# EAGLE design EXT-PHY (EAGLE 9.6.2)
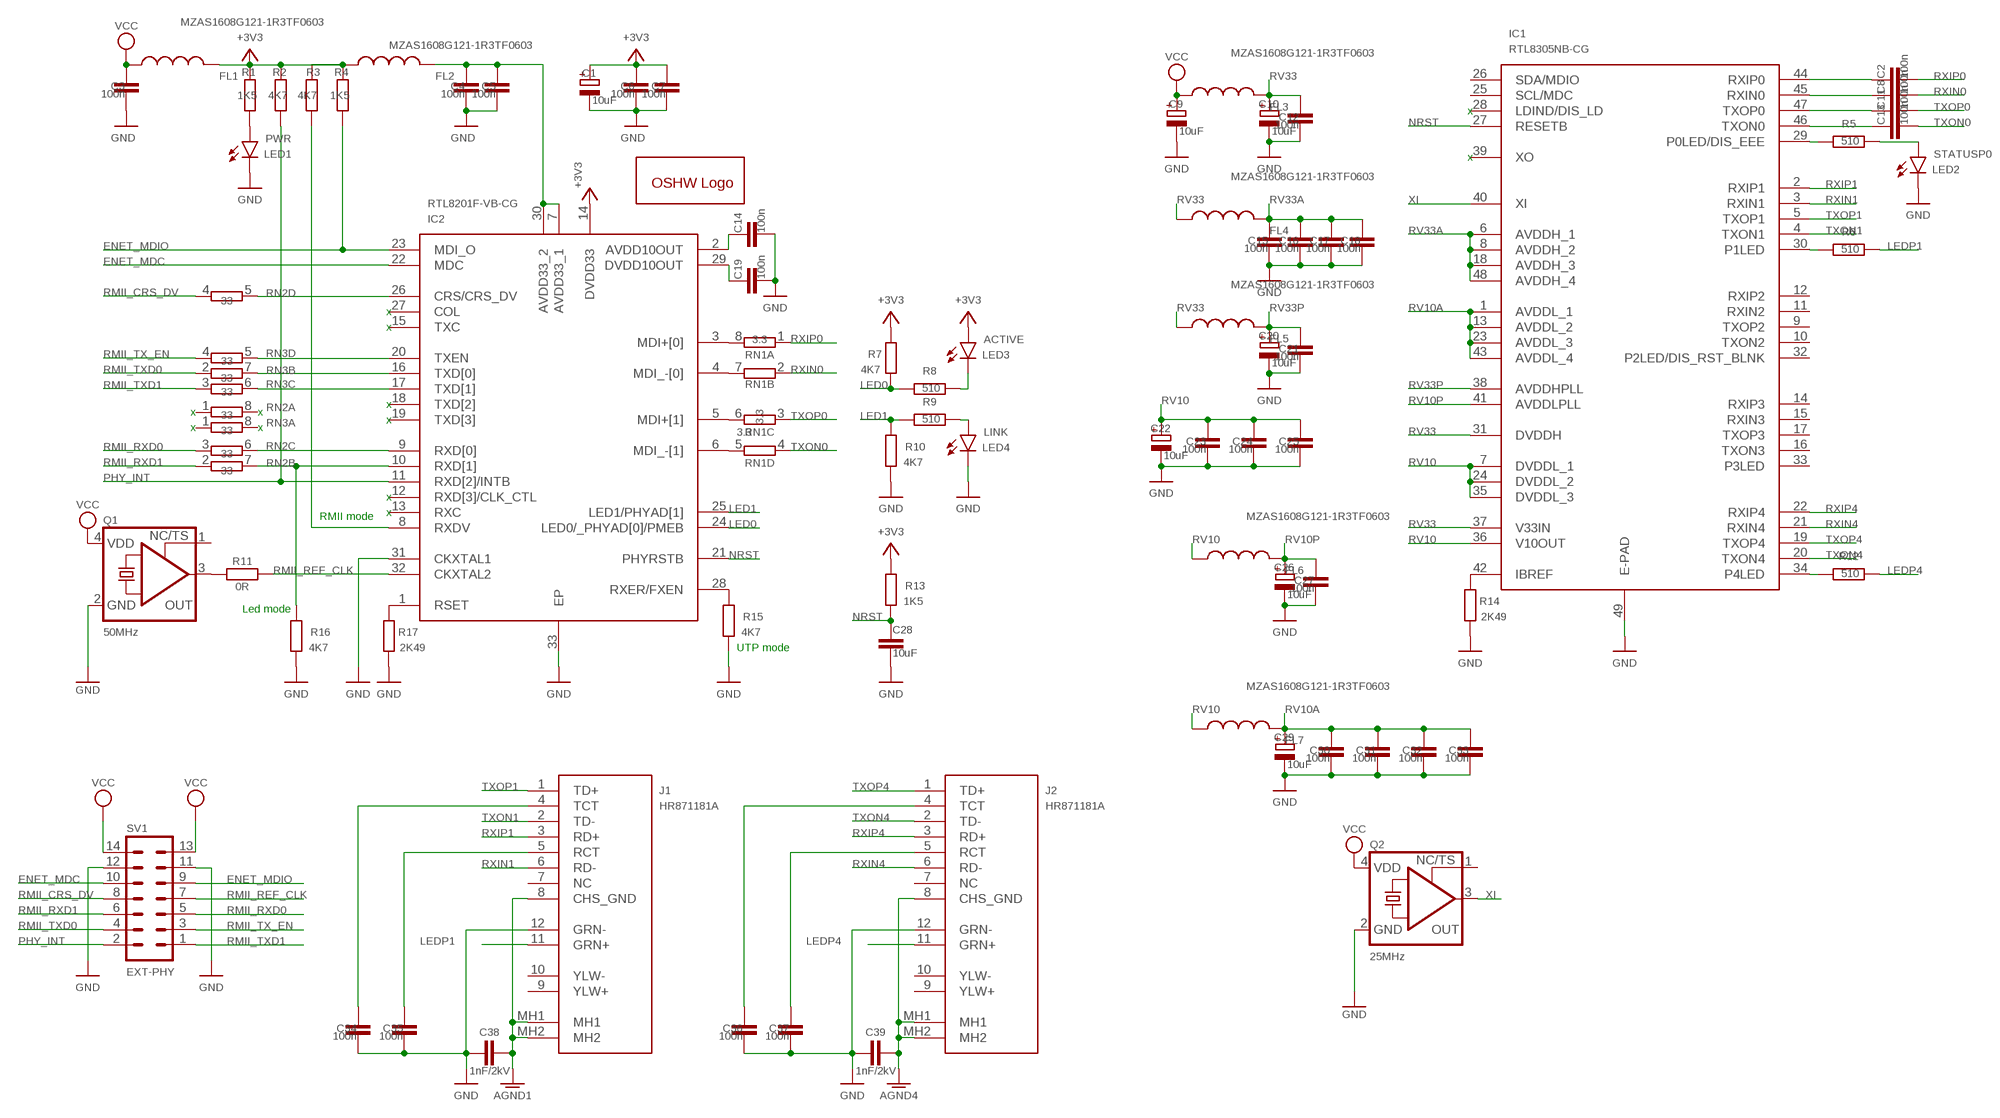
[diagram p0: schematic, sheet 1]

## Parts
C1  10uF  CPOL-EUA/3216-18R  [A/3216-18R]
C2  100n  C-EUC0402  [C0402]
C3  100n  C-EUC0402  [C0402]
C4  100n  C-EUC0402  [C0402]
C5  100n  C-EUC0402  [C0402]
C6  100n  C-EUC0402  [C0402]
C7  100n  C-EUC0402  [C0402]
C8  100n  C-EUC0402  [C0402]
C9  10uF  CPOL-EUA/3216-18R  [A/3216-18R]
C10  10uF  CPOL-EUA/3216-18R  [A/3216-18R]
C11  100n  C-EUC0402  [C0402]
C12  100n  C-EUC0402  [C0402]
C13  100n  C-EUC0402  [C0402]
C14  100n  C-EUC0402  [C0402]
C15  100n  C-EUC0402  [C0402]
C16  100n  C-EUC0402  [C0402]
C17  100n  C-EUC0402  [C0402]
C18  100n  C-EUC0402  [C0402]
C19  100n  C-EUC0402  [C0402]
C20  10uF  CPOL-EUA/3216-18R  [A/3216-18R]
C21  100n  C-EUC0402  [C0402]
C22  10uF  CPOL-EUA/3216-18R  [A/3216-18R]
C23  100n  C-EUC0402  [C0402]
C24  100n  C-EUC0402  [C0402]
C25  100n  C-EUC0402  [C0402]
C26  10uF  CPOL-EUA/3216-18R  [A/3216-18R]
C27  100n  C-EUC0402  [C0402]
C28  10uF  C-EUC0603  [C0603]
C29  10uF  CPOL-EUA/3216-18R  [A/3216-18R]
C30  100n  C-EUC0402  [C0402]
C31  100n  C-EUC0402  [C0402]
C32  100n  C-EUC0402  [C0402]
C33  100n  C-EUC0402  [C0402]
C34  100n  C-EUC0402  [C0402]
C35  100n  C-EUC0402  [C0402]
C36  100n  C-EUC0402  [C0402]
C37  100n  C-EUC0402  [C0402]
C38  1nF/2kV  C-EUC1206  [C1206]
C39  1nF/2kV  C-EUC1206  [C1206]
FL1  MZAS1608G121-1R3TF0603  [0603]
FL2  MZAS1608G121-1R3TF0603  [0603]
FL3  MZAS1608G121-1R3TF0603  [0603]
FL4  MZAS1608G121-1R3TF0603  [0603]
FL5  MZAS1608G121-1R3TF0603  [0603]
FL6  MZAS1608G121-1R3TF0603  [0603]
FL7  MZAS1608G121-1R3TF0603  [0603]
GOLD_ORB_SM1  OSHWLOGOLOGO5MM  [OSHW_5MM]
IC1  RTL8305NB-CG  [QFN40P600X600X100-49N]
IC2  RTL8201F-VB-CG  [QFN50P500X500X100-33N]
J1  HR871181A  [HR871181A]
J2  HR871181A  [HR871181A]
LED1  PWR  LEDCHIP-LED0603  [CHIP-LED0603]
LED2  STATUSP0  LEDCHIP-LED0603  [CHIP-LED0603]
LED3  ACTIVE  LEDCHIP-LED0603  [CHIP-LED0603]
LED4  LINK  LEDCHIP-LED0603  [CHIP-LED0603]
Q1  50MHz  KXO-PXO/XO-V96  [3.2X2.5_KXO-V96]
Q2  25MHz  KXO-PXO/XO-V96  [3.2X2.5_KXO-V96]
R1  1K5  R-EU_R0603  [R0603]
R2  4K7  R-EU_R0603  [R0603]
R3  4K7  R-EU_R0603  [R0603]
R4  1K5  R-EU_R0603  [R0603]
R5  510  R-EU_R0603  [R0603]
R6  510  R-EU_R0603  [R0603]
R7  4K7  R-EU_R0603  [R0603]
R8  510  R-EU_R0603  [R0603]
R9  510  R-EU_R0603  [R0603]
R10  4K7  R-EU_R0603  [R0603]
R11  0R  R-EU_R0603  [R0603]
R12  510  R-EU_R0603  [R0603]
R13  1K5  R-EU_R0603  [R0603]
R14  2K49  R-EU_R0603  [R0603]
R15  4K7  R-EU_R0603  [R0603]
R16  4K7  R-EU_R0603  [R0603]
R17  2K49  R-EU_R0603  [R0603]
RN1  3.3  4R-N0402ARV341  [4X0402ARV341]
RN2  33  4R-N0402ARV341  [4X0402ARV341]
RN3  33  4R-N0402ARV341  [4X0402ARV341]
SV1  EXT-PHY  MA07-2W  [MA07-2W]

## Nets
50MHZ: Q1.3(OUT) R11.1
+3V3: C1.+ C6.2 C7.2 FL1.2 FL2.1 IC2.14(DVDD33) LED3.A R1.2 R2.2 R3.1 R4.2 R7.2 R13.2
AGND1: C38.2 J1.8(CHS_GND) J1.MH1 J1.MH2
AGND4: C39.2 J2.8(CHS_GND) J2.MH1 J2.MH2
AVDD: C4.2 C5.2 FL2.2 IC2.7(AVDD33_1) IC2.30(AVDD33_2)
ENET_MDC: IC2.22(MDC) SV1.10
ENET_MDIO: IC2.23(MDI_O) R4.1 SV1.9
GND: C1.- C3.1 C4.1 C5.1 C6.1 C7.1 C9.- C10.- C12.1 C14.2 C15.1 C16.1 C17.1 C18.1 C19.2 C20.- C21.1 C22.- C23.1 C24.1 C25.1 C26.- C27.1 C28.2 C29.- C30.1 C31.1 C32.1 C33.1 C34.1 C35.1 C36.1 C37.1 C38.1 C39.1 IC1.49(E-PAD) IC2.31(CKXTAL1) IC2.33(EP) J1.12(GRN-) J2.12(GRN-) LED1.C LED2.C LED4.C Q1.2(GND) Q2.2(GND) R10.1 R14.2 R15.1 R16.1 R17.2 SV1.11 SV1.12
LED0: IC2.24(LED0/_PHYAD[0]/PMEB) R7.1 R8.2
LED1: IC2.25(LED1/PHYAD[1]) R9.2 R10.2
LEDP1: J1.11(GRN+) R6.1
LEDP4: J2.11(GRN+) R12.1
N$1: LED1.A R1.1
N$2: C37.2 J2.5(RCT)
N$3: C36.2 J2.4(TCT)
N$4: IC2.1(RSET) R17.1
N$5: IC2.8(RXDV) R3.2
N$6: C14.1 IC2.2(AVDD10OUT)
N$7: IC2.28(RXER/FXEN) R15.2
N$8: IC1.42(IBREF) R14.1
N$9: C35.2 J1.5(RCT)
N$10: C34.2 J1.4(TCT)
N$11: C19.1 IC2.29(DVDD10OUT)
N$12: IC1.30(P1LED) R6.2
N$13: IC1.34(P4LED) R12.2
N$14: IC2.3(MDI+[0]) RN1.8
N$15: LED3.C R8.1
N$16: IC2.4(MDI_-[0]) RN1.7
N$17: IC2.5(MDI+[1]) RN1.6
N$18: IC2.6(MDI_-[1]) RN1.5
N$19: LED2.A R5.1
N$20: IC1.29(P0LED/DIS_EEE) R5.2
N$24: C13.1 IC1.46(TXON0)
N$26: C11.1 IC1.47(TXOP0)
N$27: C8.1 IC1.45(RXIN0)
N$28: C2.1 IC1.44(RXIP0)
N$29: LED4.A R9.1
NRST: C28.1 IC1.27(RESETB) IC2.21(PHYRSTB) R13.1
PHY_INT: IC2.11(RXD[2]/INTB) R2.1 SV1.2
RMII_CRS_DV: RN2.4 SV1.8
RMII_REF_CLK: IC2.32(CKXTAL2) R11.2 SV1.7
RMII_RXD0: RN2.3 SV1.5
RMII_RXD1: RN2.2 SV1.6
RMII_TX_EN: RN3.4 SV1.3
RMII_TXD0: RN3.2 SV1.4
RMII_TXD1: RN3.3 SV1.1
RV10: C22.+ C23.2 C24.2 C25.2 FL6.1 FL7.1 IC1.7(DVDDL_1) IC1.24(DVDDL_2) IC1.35(DVDDL_3) IC1.36(V10OUT)
RV10A: C29.+ C30.2 C31.2 C32.2 C33.2 FL7.2 IC1.1(AVDDL_1) IC1.13(AVDDL_2) IC1.23(AVDDL_3) IC1.43(AVDDL_4)
RV10P: C26.+ C27.2 FL6.2 IC1.41(AVDDLPLL)
RV33: C10.+ C12.2 FL3.2 FL4.1 FL5.1 IC1.31(DVDDH) IC1.37(V33IN)
RV33A: C15.2 C16.2 C17.2 C18.2 FL4.2 IC1.6(AVDDH_1) IC1.8(AVDDH_2) IC1.18(AVDDH_3) IC1.48(AVDDH_4)
RV33P: C20.+ C21.2 FL5.2 IC1.38(AVDDHPLL)
RXD0: IC2.9(RXD[0]) RN2.6
RXD1: IC2.10(RXD[1]) R16.2 RN2.7
RXDV: IC2.26(CRS/CRS_DV) RN2.5
RXIN0: C8.2 RN1.2
RXIN1: IC1.3(RXIN1) J1.6(RD-)
RXIN4: IC1.21(RXIN4) J2.6(RD-)
RXIP0: C2.2 RN1.1
RXIP1: IC1.2(RXIP1) J1.3(RD+)
RXIP4: IC1.22(RXIP4) J2.3(RD+)
TXD0: IC2.16(TXD[0]) RN3.7
TXD1: IC2.17(TXD[1]) RN3.6
TXEN: IC2.20(TXEN) RN3.5
TXON0: C13.2 RN1.4
TXON1: IC1.4(TXON1) J1.2(TD-)
TXON4: IC1.20(TXON4) J2.2(TD-)
TXOP0: C11.2 RN1.3
TXOP1: IC1.5(TXOP1) J1.1(TD+)
TXOP4: IC1.19(TXOP4) J2.1(TD+)
VCC: C3.2 C9.+ FL1.1 FL3.1 Q1.4(VDD) Q2.4(VDD) SV1.13 SV1.14
XI: IC1.40(XI) Q2.3(OUT)
Unconnected: IC1.9(TXOP2) IC1.10(TXON2) IC1.11(RXIN2) IC1.12(RXIP2) IC1.14(RXIP3) IC1.15(RXIN3) IC1.16(TXON3) IC1.17(TXOP3) IC1.25(SCL/MDC) IC1.26(SDA/MDIO) IC1.28(LDIND/DIS_LD) IC1.32(P2LED/DIS_RST_BLNK) IC1.33(P3LED) IC1.39(XO) IC2.12(RXD[3]/CLK_CTL) IC2.13(RXC) IC2.15(TXC) IC2.18(TXD[2]) IC2.19(TXD[3]) IC2.27(COL) J1.7(NC) J1.9(YLW+) J1.10(YLW-) J2.7(NC) J2.9(YLW+) J2.10(YLW-) Q1.1(TS) Q2.1(TS) RN2.1 RN2.8 RN3.1 RN3.8

## Notes on the sheet
- x
- x
- x
- x
- x
- x | x
- x
- x | x
- x
- x
- RMII mode
- Led mode
- UTP mode

## Library data of the parts
C1 C9 C10 C20 C22 C26 C29 = rcl:CPOL-EU: POLARIZED CAPACITOR, European symbol; JLCPCB: C7171; SPICEPREFIX: C
C2-C8 C11-C19 C21 C23-C25 C27 C30-C37 = rcl:C-EU: CAPACITOR, European symbol; JLCPCB: C1525; SPICEPREFIX: C
C28 = rcl:C-EU: CAPACITOR, European symbol; JLCPCB: C19702; SPICEPREFIX: C
C38 C39 = rcl:C-EU: CAPACITOR, European symbol; JLCPCB: C9196; SPICEPREFIX: C
FL1-FL7 = Ethernet:MZAS1608G121-1R3TF: 1.3A 1 140mΩ 120Ω@100MHz ±25% 0603 Ferrite Beads ROHS; JLCPCB: C709642
GOLD_ORB_SM1 = oshw:OSHWLOGO: The OSHW logo for PCB layout
IC1 = Ethernet:RTL8305NB-CG: 5-port 10/100 Network switch Source: Datasheet <https://www.openhacks.com/uploadsproductos/realtek-semicon-rtl8305nb-cg-qfn-48_c52146.pdf>; DESCRIPTION: 5-port 10/100 Network switch; JLCPCB: C3010343; MANUFACTURER_NAME: Realtek; MANUFACTURER_PART_NUMBER: RTL8305NB-CG
IC2 = Ethernet:RTL8201F-VB-CG: RTL8201F Series 3.63 V Single Chip/Port 10/100 M Ethernet Phyceiver w/ auto MDIX Source: Datasheet <https://pdf1.alldatasheet.com/datasheet-pdf/view/1132250/REALTEK/RTL8201F-VB-CG.html>; DESCRIPTION: RTL8201F Series 3.63 V Single Chip/Port 10/100 M Ethernet Phyceiver w/ auto MDIX; JLCPCB: C45044; MANUFACTURER_NAME: Realtek; MANUFACTURER_PART_NUMBER: RTL8201F-VB-CG
J1 J2 = Ethernet:HR871181A: RJ45 12 1 Shielded Green - Yellow Through Hole Ethernet Connectors/Modular Connectors (RJ45 RJ11) RoHS Source: Datasheet <https://datasheet.lcsc.com/szlcsc/1811141116_HANRUN-Zhongshan-HanRun-Elec-HR871181A_C49312.pdf>; DESCRIPTION: RJ45 12 1 Shielded Green - Yellow Through Hole Ethernet Connectors/Modular Connectors (RJ45 RJ11) RoHS; JLCPCB: C49312; MANUFACTURER_NAME: Hanrun Electronics; MANUFACTURER_PART_NUMBER: HR871181A
LED1-LED4 = led:LED: LED OSRAM: - CHIPLED LG R971, LG N971, LY N971, LG Q971, LY Q971, LO R971, LY R971 LH N974, LH R974 LS Q976, LO Q976, LY Q976 LO Q996 - Hyper CHIPLED LW Q18S LB Q993, LB Q99A, LB R99A - SideLED LS A670, LO A670, LY A670, LG A670, LP A670 LB A673, LV A673, LT A673, LW A673 LH A674 LY A675 LS A676, LA A676, LO A676, LY A676, LW A676 LS A679, LY A679, LG A679 - Hyper Micro SIDELED® LS Y876, LA Y876, LO Y876, LY Y876 LT Y87S - SmartLED LW L88C, LW L88S LB L89C, LB L89S, LG L890 LS L89K, LO L89K, LY L89K LS L896, LA L896, LO L896, LY L896 - TOPLED LS T670, LO T670, LY T670, LG T670, LP T670 LSG T670, LSP T670, LSY T670, LOP T670, LYG T670 LG T671, LOG T671, LSG T671 LB T673, LV T673, LT T673, LW T673 LH T674 LS T676, LA T676, LO T676, LY T676, LB T676, LH T676, LSB T676, LW T676 LB T67C, LV T67C, LT T67C, LS T67K, LO T67K, LY T67K, LW E67C LS E67B, LA E67B, LO E67B, LY E67B, LB E67C, LV E67C, LT E67C LW T67C LS T679, LY T679, LG T679 LS T770, LO T770, LY T770, LG T770, LP T770 LB T773, LV T773, LT T773, LW T773 LH T774 LS E675, LA E675, LY E675, LS T675 LS T776, LA T776, LO T776, LY T776, LB T776 LHGB T686 LT T68C, LB T68C - Hyper Mini TOPLED® LB M676 - Mini TOPLED Santana® LG M470 LS M47K, LO M47K, LY M47K Source: http://www.osram.convergy.de LUXEON: - LUMILED® LXK2-PW12-R00, LXK2-PW12-S00, LXK2-PW14-U00, LXK2-PW14-V00 LXK2-PM12-R00, LXK2-PM12-S00, LXK2-PM14-U00 LXK2-PE12-Q00, LXK2-PE12-R00, LXK2-PE12-S00, LXK2-PE14-T00, LXK2-PE14-U00 LXK2-PB12-K00, LXK2-PB12-L00, LXK2-PB12-M00, LXK2-PB14-N00, LXK2-PB14-P00, LXK2-PB14-Q00 LXK2-PR12-L00, LXK2-PR12-M00, LXK2-PR14-Q00, LXK2-PR14-R00 LXK2-PD12-Q00, LXK2-PD12-R00, LXK2-PD12-S00 LXK2-PH12-R00, LXK2-PH12-S00 LXK2-PL12-P00, LXK2-PL12-Q00, LXK2-PL12-R00 Source: www.luxeon.com KINGBRIGHT: KA-3528ASYC Source: www.kingbright.com; JLCPCB: C72043
Q1 = crystal-geyer_V1_0:KXO-PXO/XO-V: Clock Oscillator (PXO/XO) MHz : KXO-V - Serie Model Size l/w/h [mm] Frequency Range Frequency Stability Temp. Range [°C] Output AECQ 200 availabel Datasheet KXO-V94 KXO-V94 KXO-V95 KXO-V95 KXO-V96 KXO-V96 KXO-V99 KXO-V99 KXO-97 KXO-V97 KXO-97 - KXO-V97 2.0/1.6/0.80 2.0/1.6/0.80 2.5/2.0/0.82 2.5/2.0/0.82 3.2/2.5/1.2 3.2/2.5/1.2 5.0/3.2/1.2 5.0/3.2/1.2 7.0/5.08/1.3 7.0/5.08/1.3 7.0/5.08/1.3 32,768 kHz 1,0 ~ 80,0 MHz 32,768 kHz 1,0 ~ 70,0 MHz 32,768 kHz 1,0 ~ 156,0 MHz 32,768 kHz 1,0 ~ 200,0 MHz 32,768 kHz 32,768 kHz 1,0 ~ 160,0 MHz ±25 … ±100ppm ±25 … ±100ppm ±25 … ±100ppm ±25 … ±100ppm ±25 … ±100ppm ±25 … ±100ppm ±25 … ±100ppm ±25 … ±100ppm ±25 … ±100ppm ±25 … ±100ppm ±25 … ±100ppm (*) -40°C …+85°C (*) -40°C …+85°C (*) -40°C …+85°C (*) -40°C …+85°C (*) -40°C …+85°C (*) -40°C …+85°C (*) -40°C …+85°C (*) -40°C …+85°C (*) -40°C …+85°C (*) -40°C …+85°C (*) -40°C …+85°C HCMOS HCMOS HCMOS HCMOS HCMOS HCMOS HCMOS HCMOS HCMOS HCMOS HCMOS - - yes yes yes yes - - - - - KXO-V94-kHz.pdf <http://www.geyer-electronic.de/uploads/tx_userartikelfrequenz/GEYER-KXO-V94-kHz.pdf> KXO-V94.pdf <http://www.geyer-electronic.de/uploads/tx_userartikelfrequenz/GEYER-KXO-V94.pdf> KXO-V95-kHz.pdf <http://www.geyer-electronic.de/uploads/tx_userartikelfrequenz/GEYER-KXO-V95-kHz.pdf> KXO-V95.pdf <http://www.geyer-electronic.de/uploads/tx_userartikelfrequenz/GEYER-KXO-V95.pdf> KXO-V96-kHz.pdf <http://www.geyer-electronic.de/uploads/tx_userartikelfrequenz/GEYER-KXO-V96-kHz.pdf> KXO-V96.pdf <http://www.geyer-electronic.de/uploads/tx_userartikelfrequenz/GEYER-KXO-V96.pdf> KXO-V99-kHz.pdf <http://www.geyer-electronic.de/uploads/tx_userartikelfrequenz/GEYER-KXO-V99-kHz.pdf> KXO-V99.pdf <http://www.geyer-electronic.de/uploads/tx_userartikelfrequenz/GEYER-KXO-V99.pdf> KXO-97-kHz.pdf <http://www.geyer-electronic.de/uploads/tx_userartikelfrequenz/GEYER-KXO-97-kHz.pdf> KXO-V97-kHz.pdf <http://www.geyer-electronic.de/uploads/tx_userartikelfrequenz/GEYER-KXO-V97-kHz.pdf> KXO-V97.pdf <http://www.geyer-electronic.de/uploads/tx_userartikelfrequenz/GEYER-KXO-V97.pdf> <http://www.geyer-electronic.de/fileadmin/template/img/logo-geyer-electronic.png> Details see: http://www.geyer-electronic.de/Frequenz-Produkte.9.0.html Created 2016-06-07, Hans Locher 2016 (C) Geyer Quartz Technology Hans Locher KXOV94,KXOV95;KXOV96;KXOV97;KXO97;2016;2520;3225;5032;70508;2,5x2,0;3,2x2,5;5,0x3,2;7,0x5,08;2.5x2.0;3.2x2.5;5.0x3.2;7.0x5.08;; JLCPCB: C160451
Q2 = crystal-geyer_V1_0:KXO-PXO/XO-V: Clock Oscillator (PXO/XO) MHz : KXO-V - Serie Model Size l/w/h [mm] Frequency Range Frequency Stability Temp. Range [°C] Output AECQ 200 availabel Datasheet KXO-V94 KXO-V94 KXO-V95 KXO-V95 KXO-V96 KXO-V96 KXO-V99 KXO-V99 KXO-97 KXO-V97 KXO-97 - KXO-V97 2.0/1.6/0.80 2.0/1.6/0.80 2.5/2.0/0.82 2.5/2.0/0.82 3.2/2.5/1.2 3.2/2.5/1.2 5.0/3.2/1.2 5.0/3.2/1.2 7.0/5.08/1.3 7.0/5.08/1.3 7.0/5.08/1.3 32,768 kHz 1,0 ~ 80,0 MHz 32,768 kHz 1,0 ~ 70,0 MHz 32,768 kHz 1,0 ~ 156,0 MHz 32,768 kHz 1,0 ~ 200,0 MHz 32,768 kHz 32,768 kHz 1,0 ~ 160,0 MHz ±25 … ±100ppm ±25 … ±100ppm ±25 … ±100ppm ±25 … ±100ppm ±25 … ±100ppm ±25 … ±100ppm ±25 … ±100ppm ±25 … ±100ppm ±25 … ±100ppm ±25 … ±100ppm ±25 … ±100ppm (*) -40°C …+85°C (*) -40°C …+85°C (*) -40°C …+85°C (*) -40°C …+85°C (*) -40°C …+85°C (*) -40°C …+85°C (*) -40°C …+85°C (*) -40°C …+85°C (*) -40°C …+85°C (*) -40°C …+85°C (*) -40°C …+85°C HCMOS HCMOS HCMOS HCMOS HCMOS HCMOS HCMOS HCMOS HCMOS HCMOS HCMOS - - yes yes yes yes - - - - - KXO-V94-kHz.pdf <http://www.geyer-electronic.de/uploads/tx_userartikelfrequenz/GEYER-KXO-V94-kHz.pdf> KXO-V94.pdf <http://www.geyer-electronic.de/uploads/tx_userartikelfrequenz/GEYER-KXO-V94.pdf> KXO-V95-kHz.pdf <http://www.geyer-electronic.de/uploads/tx_userartikelfrequenz/GEYER-KXO-V95-kHz.pdf> KXO-V95.pdf <http://www.geyer-electronic.de/uploads/tx_userartikelfrequenz/GEYER-KXO-V95.pdf> KXO-V96-kHz.pdf <http://www.geyer-electronic.de/uploads/tx_userartikelfrequenz/GEYER-KXO-V96-kHz.pdf> KXO-V96.pdf <http://www.geyer-electronic.de/uploads/tx_userartikelfrequenz/GEYER-KXO-V96.pdf> KXO-V99-kHz.pdf <http://www.geyer-electronic.de/uploads/tx_userartikelfrequenz/GEYER-KXO-V99-kHz.pdf> KXO-V99.pdf <http://www.geyer-electronic.de/uploads/tx_userartikelfrequenz/GEYER-KXO-V99.pdf> KXO-97-kHz.pdf <http://www.geyer-electronic.de/uploads/tx_userartikelfrequenz/GEYER-KXO-97-kHz.pdf> KXO-V97-kHz.pdf <http://www.geyer-electronic.de/uploads/tx_userartikelfrequenz/GEYER-KXO-V97-kHz.pdf> KXO-V97.pdf <http://www.geyer-electronic.de/uploads/tx_userartikelfrequenz/GEYER-KXO-V97.pdf> <http://www.geyer-electronic.de/fileadmin/template/img/logo-geyer-electronic.png> Details see: http://www.geyer-electronic.de/Frequenz-Produkte.9.0.html Created 2016-06-07, Hans Locher 2016 (C) Geyer Quartz Technology Hans Locher KXOV94,KXOV95;KXOV96;KXOV97;KXO97;2016;2520;3225;5032;70508;2,5x2,0;3,2x2,5;5,0x3,2;7,0x5,08;2.5x2.0;3.2x2.5;5.0x3.2;7.0x5.08;; JLCPCB: C160454
R1 R4 R13 = rcl:R-EU_: RESISTOR, European symbol; JLCPCB: C22843; SPICEPREFIX: R
R2 R3 R7 R10 R15 R16 = rcl:R-EU_: RESISTOR, European symbol; JLCPCB: C23162; SPICEPREFIX: R
R5 R6 R8 R9 R12 = rcl:R-EU_: RESISTOR, European symbol; JLCPCB: C23193; SPICEPREFIX: R
R11 = rcl:R-EU_: RESISTOR, European symbol; JLCPCB: C115304; SPICEPREFIX: R
R14 R17 = rcl:R-EU_: RESISTOR, European symbol; JLCPCB: C100897; SPICEPREFIX: R
RN1 = resistor-dil:4R-N: Array Chip Resistor Source: RS Component / Phycomp; JLCPCB: C728736; OC_FARNELL: unknown; OC_NEWARK: unknown
RN2 RN3 = resistor-dil:4R-N: Array Chip Resistor Source: RS Component / Phycomp; JLCPCB: C25501; OC_FARNELL: unknown; OC_NEWARK: unknown
SV1 = con-lstb:MA07-2W: PIN HEADER; OC_FARNELL: unknown; OC_NEWARK: unknown

## Board
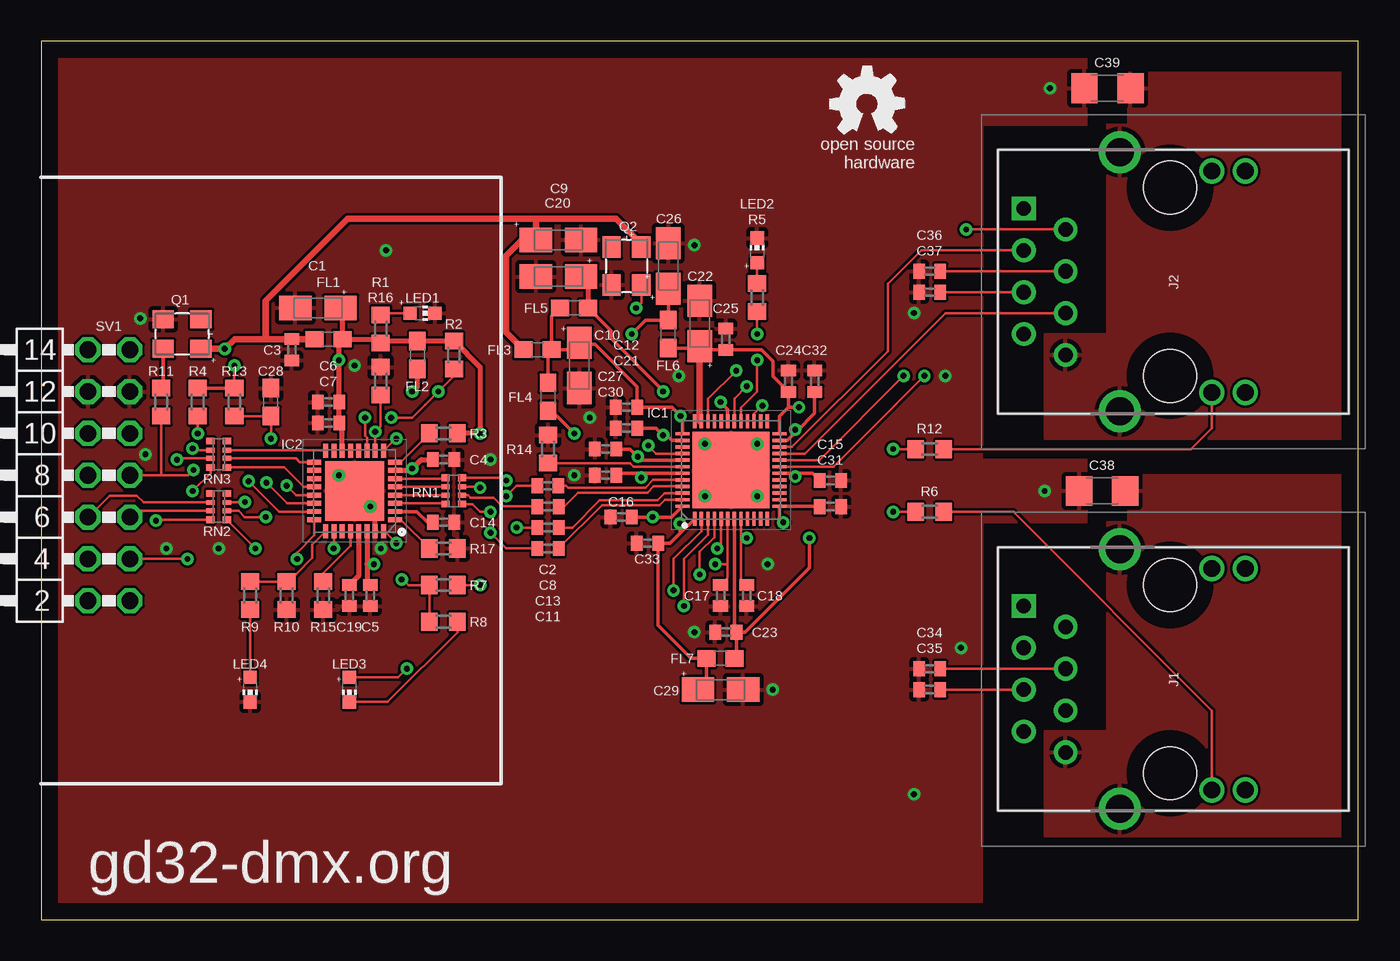
[diagram p1: board, top side]
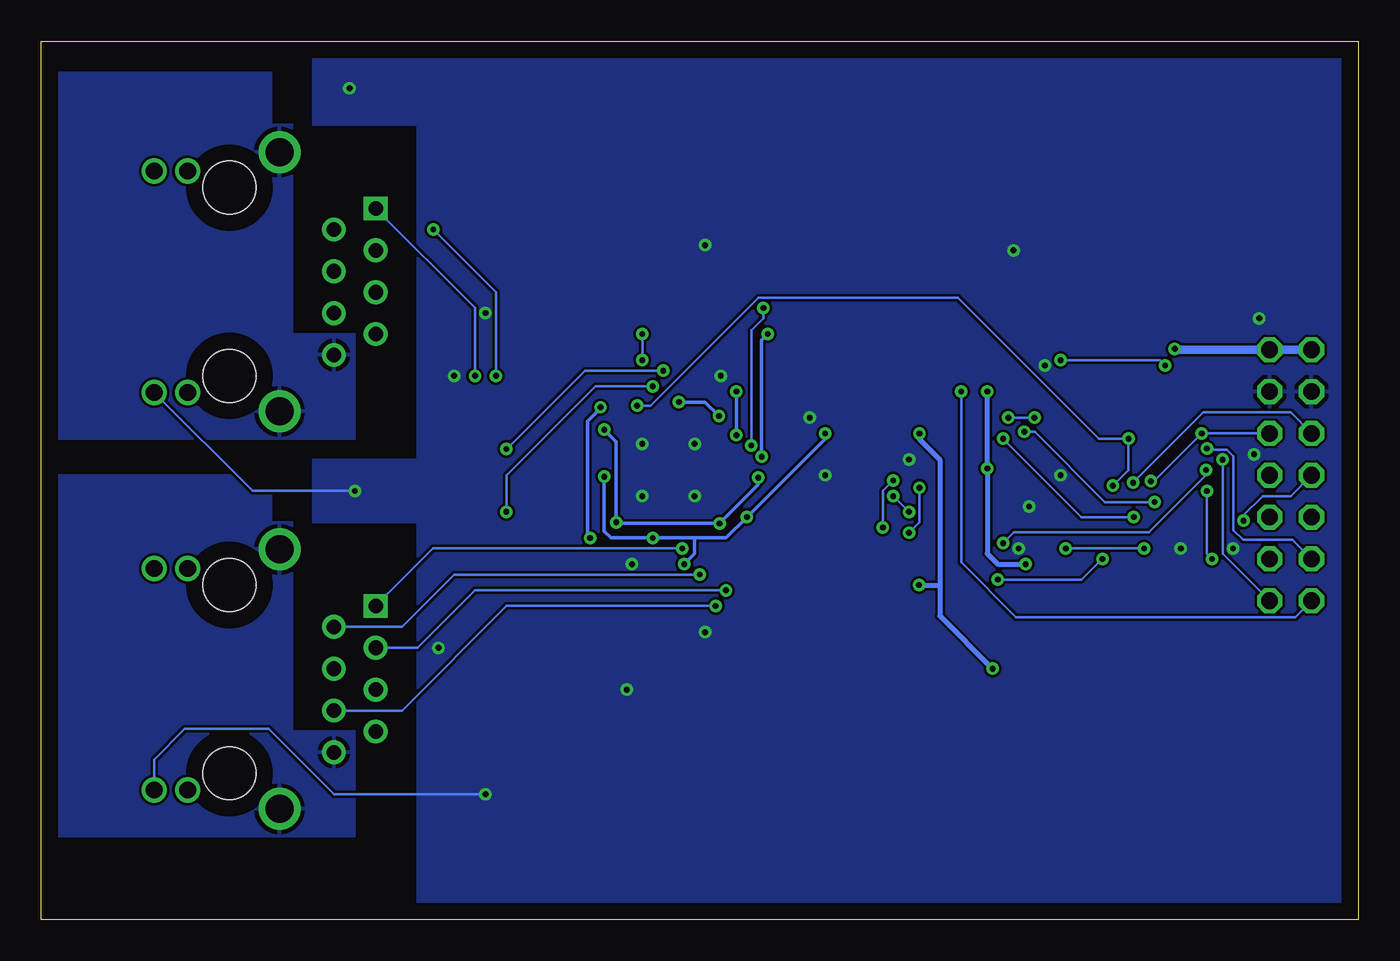
[diagram p2: board, bottom side, seen from below]

Size 80 x 53.33 mm. Coordinates in mm from the lower left corner, seen from the top.
Outline: 80,53.33 0,53.33 0,0 80,0 80,53.33
Copper layers (1*16): Top 0.035mm / dielectric 1.5mm / Bottom 0.035mm
Design rules "default": minimum track width 6mil, minimum drill 0.35mm, track to track 6mil, track to pad 6mil, pad to pad 6mil, via to via 6mil, smd to smd 6mil, copper to edge 40mil, drill to drill 6mil, minimum pad ring 10mil, minimum via ring 8mil, stop-mask expansion 4mil, vias tented up to drill 0mil, thermal gap 10mil

### Footprints (pad centres in the part's own frame; a part is rotated, then mirrored left to right if it is on the bottom)
A/3216-18R = smd 1.95 x 1.5: + 1.375,0; - -1.375,0
C0402 = smd 0.7 x 0.9: 1 -0.65,0; 2 0.65,0
C0603 = smd 1.1 x 1: 1 -0.85,0; 2 0.85,0
C1206 = smd 1.6 x 1.8: 1 -1.4,0; 2 1.4,0
0603 = smd 1.1 x 1: 1 -0.85,0; 2 0.85,0
QFN40P600X600X100-49N = smd 0.85 x 0.2: 1 -2.95,2.2; 2 -2.95,1.8; 3 -2.95,1.4; 4 -2.95,1; 5 -2.95,0.6; 6 -2.95,0.2; 7 -2.95,-0.2; 8 -2.95,-0.6; 9 -2.95,-1; 10 -2.95,-1.4; 11 -2.95,-1.8; 12 -2.95,-2.2; 25 2.95,-2.2; 26 2.95,-1.8; 27 2.95,-1.4; 28 2.95,-1; 29 2.95,-0.6; 30 2.95,-0.2; 31 2.95,0.2; 32 2.95,0.6; 33 2.95,1; 34 2.95,1.4; 35 2.95,1.8; 36 2.95,2.2 | smd 0.2 x 0.85: 13 -2.2,-2.95; 14 -1.8,-2.95; 15 -1.4,-2.95; 16 -1,-2.95; 17 -0.6,-2.95; 18 -0.2,-2.95; 19 0.2,-2.95; 20 0.6,-2.95; 21 1,-2.95; 22 1.4,-2.95; 23 1.8,-2.95; 24 2.2,-2.95; 37 2.2,2.95; 38 1.8,2.95; 39 1.4,2.95; 40 1,2.95; 41 0.6,2.95; 42 0.2,2.95; 43 -0.2,2.95; 44 -0.6,2.95; 45 -1,2.95; 46 -1.4,2.95; 47 -1.8,2.95; 48 -2.2,2.95 | smd 4.65 x 4.65: 49 0,0
QFN50P500X500X100-33N = smd 0.85 x 0.3: 1 -2.45,1.75; 2 -2.45,1.25; 3 -2.45,0.75; 4 -2.45,0.25; 5 -2.45,-0.25; 6 -2.45,-0.75; 7 -2.45,-1.25; 8 -2.45,-1.75; 17 2.45,-1.75; 18 2.45,-1.25; 19 2.45,-0.75; 20 2.45,-0.25; 21 2.45,0.25; 22 2.45,0.75; 23 2.45,1.25; 24 2.45,1.75 | smd 0.3 x 0.85: 9 -1.75,-2.45; 10 -1.25,-2.45; 11 -0.75,-2.45; 12 -0.25,-2.45; 13 0.25,-2.45; 14 0.75,-2.45; 15 1.25,-2.45; 16 1.75,-2.45; 25 1.75,2.45; 26 1.25,2.45; 27 0.75,2.45; 28 0.25,2.45; 29 -0.25,2.45; 30 -0.75,2.45; 31 -1.25,2.45; 32 -1.75,2.45 | smd 3.6 x 3.6: 33 0,0
HR871181A = drill 0.89 pad 1.446 square: 1 0,0 | drill 0.89 pad 1.446: 2 1.27,2.54; 3 2.54,0; 4 3.81,2.54; 5 5.08,0; 6 6.35,2.54; 7 7.62,0; 8 8.89,2.54 | drill 1.02 pad 1.53: 9 -2.28,11.43; 10 -2.28,13.46; 11 11.17,11.43; 12 11.17,13.46 | drill 1.7 pad 2.55: MH1 -3.43,5.84; MH2 12.32,5.84 | hole 3.2: -1.27,8.89; 10.16,8.89
CHIP-LED0603 = smd 0.8 x 0.8: A 0,-0.75; C 0,0.75
3.2X2.5_KXO-V96 = smd 1.3 x 1.1: 1 -1.15,-0.9; 2 1.15,-0.9; 3 1.15,0.9; 4 -1.15,0.9
R0603 = smd 1 x 1.1: 1 -0.85,0; 2 0.85,0
4X0402ARV341 = smd 0.4 x 0.5: 1 -0.8,-0.5; 4 0.8,-0.5; 5 0.8,0.5; 8 -0.8,0.5 | smd 0.3 x 0.5: 2 -0.25,-0.5; 3 0.25,-0.5; 6 0.25,0.5; 7 -0.25,0.5
MA07-2W = drill 1.016 octagon: 1 -7.62,-1.27; 2 -7.62,1.27; 3 -5.08,-1.27; 4 -5.08,1.27; 5 -2.54,-1.27; 6 -2.54,1.27; 7 0,-1.27; 8 0,1.27; 9 2.54,-1.27; 10 2.54,1.27; 11 5.08,-1.27; 12 5.08,1.27; 13 7.62,-1.27; 14 7.62,1.27

### Placement (x,y rotation side)
C1  16.82,37.14 0 top
C2  30.77,26.34 180 top
C3  15.23,34.6 90 top
C4  24.44,27.93 180 top
C5  19.99,19.67 90 top
C6  17.45,31.42 0 top
C7  17.45,30.15 0 top
C8  30.79,25.07 180 top
C9  31.42,41.27 180 top
C10  32.69,33.65 90 top
C11  30.79,22.53 180 top
C12  35.55,31.1 0 top
C13  30.79,23.8 180 top
C14  24.44,24.12 0 top
C15  47.93,26.66 180 top
C16  35.23,24.44 0 top
C17  41.26,19.67 90 top
C18  42.85,19.67 90 top
C19  18.72,19.67 270 top
C20  31.42,39.04 0 top
C21  35.55,29.83 0 top
C22  39.99,36.19 270 top
C23  41.58,17.45 0 top
C24  45.39,32.69 270 top
C25  41.58,35.23 270 top
C26  38.09,39.68 270 top
C27  34.28,28.56 0 top
C28  13.96,31.42 90 top
C29  41.26,13.96 180 top
C30  34.28,26.98 0 top
C31  47.93,25.07 180 top
C32  46.98,32.69 270 top
C33  36.82,22.85 0 top
C34  53.96,15.23 0 top
C35  53.96,13.96 0 top
C36  53.96,39.36 0 top
C37  53.96,38.09 0 top
C38  64.44,26.02 0 top
C39  64.76,50.47 0 top
FL1  17.45,35.23 0 top
FL2  22.85,34.28 270 top
FL3  30.15,34.6 0 top
FL4  30.79,31.74 270 top
FL5  32.37,37.14 0 top
FL6  38.09,35.55 90 top
FL7  41.26,15.87 180 top
GOLD_ORB_SM1  50.15,49.52 0 top
IC1  41.9,27.29 90 top
IC2  19.04,26.02 180 top
J1  59.68,19.04 270 top
J2  59.68,43.17 270 top
LED1  23.16,36.82 270 top
LED2  43.48,40.63 0 top
LED3  18.72,13.96 180 top
LED4  12.69,13.96 180 top
Q1  8.56,35.55 180 top
Q2  35.55,39.68 270 top
R1  20.62,35.87 270 top
R2  25.07,34.28 90 top
R3  24.44,29.52 180 top
R4  9.51,31.42 90 top
R5  43.48,37.77 270 top
R6  53.96,24.75 180 top
R7  24.44,20.31 0 top
R8  24.44,18.09 180 top
R9  12.69,19.67 90 top
R10  14.91,19.67 90 top
R11  7.29,31.42 270 top
R12  53.96,28.56 180 top
R13  11.74,31.42 90 top
R14  30.79,28.56 90 top
R15  17.13,19.67 90 top
R16  20.62,32.69 270 top
R17  24.44,22.53 0 top
RN1  25.07,26.02 90 top
RN2  10.78,25.07 270 top
RN3  10.78,28.25 270 top
SV1  4.12,26.98 90 top

### Tracks (layer width: path | path; a pad name or v marks a point on that pad's centre or on a via)
50MHZ
  Top 0.203: Q1.3 7.41,32.39 R11.1
+3V3  (via drill 0.35)
  Top 0.152: R13.2 v11.74,33.65 | v26.69,20.31 R7.2 | v22.21,15.23 21.69,14.71 LED3.A
  Top 0.2: R4.2 R13.2
  Top 0.305: FL1.2 18.3,37.03 C1.+ | FL1.2 20.41,35.23 R1.2 20.74,35.13 FL2.1 R2.2 26.66,33.54 v26.66,29.52 R3.1 | IC2.14 18.29,29.96 C7.2 C6.2 18.1,33.96 | 18.1,33.96 18.1,35.03 FL1.2 | v18.09,33.96 18.1,33.96
  Bottom 0.152: v11.74,33.65 12.05,33.96 v18.09,33.96
  Bottom 0.305: v26.66,29.52 26.66,29.17 25.42,27.93 25.42,20.31 | v22.21,15.23 25.42,18.43 25.42,20.31 | v26.69,20.31 25.42,20.31
AGND1
  pour Top: 80,5.07 60.95,5.07 60.95,11.42 64.76,11.42 64.76,24.12 66.03,24.12 66.03,26.98 80,26.98
  pour Bottom: 60.95,5.07 80,5.07 80,26.98 66.03,26.98 66.03,24.12 64.76,24.12 64.76,11.42 60.95,11.42
AGND4
  pour Bottom: 80,51.43 80,29.2 60.95,29.2 60.95,35.55 64.76,35.55 64.76,48.25 66.03,48.25 66.03,51.43
  pour Top: 80,51.43 80,29.2 60.95,29.2 60.95,35.55 64.76,35.55 64.76,48.25 66.03,48.25 66.03,51.43
AVDD  (via drill 0.35)
  Top 0.305: v22.53,32.06 22.85,32.38 FL2.2 | IC2.30 19.79,21.58 | 19.79,21.58 19.79,20.53 C5.2 | v20.21,21.58 19.79,21.58 | IC2.7 22.42,27.27 v22.53,27.38 23.08,27.93 C4.2
  Bottom 0.305: v20.21,21.58 21.89,21.58 22.53,22.21 v22.53,27.38 v22.53,32.06
ENET_MDC  (via drill 0.35)
  Top 0.152: v13.68,26.52 14.93,25.27 IC2.22
  Bottom 0.152: SV1.10 4.12,30.79 9.42,30.79 v13.68,26.52
ENET_MDIO  (via drill 0.35)
  Top 0.152: v12.6,26.62 14.45,24.77 IC2.23 | R4.1 v9.51,29.52
  Bottom 0.152: SV1.9 v9.51,29.52 12.41,26.62 v12.6,26.62
GND  (via drill 0.35)
  Top 0.203: IC1.49 v40.31,28.88
  Top 0.305: IC2.31 20.29,24.77 IC2.33
  Bottom 0.152: v60.95,26.02 67.16,26.02 J2.12 | J1.12 73.14,9.71 71.27,11.57 66.18,11.57 62.22,7.61 v53.01,7.61
  other vias: 6.02,36.5 10.78,22.53 20.62,22.53 19.04,33.65 6.34,28.25 19.99,25.07 18.09,26.98 7.61,22.53 61.27,50.47 33.32,30.47 43.48,28.88 43.48,25.71 40.31,25.71 54.91,33.01 39.67,17.45 44.12,21.58 38.72,33.01 55.87,16.5 27.29,27.93 20.94,40.63 39.67,40.95 44.44,13.96 32.37,26.98 53.01,36.82
  pour Top: 57.14,-0.01 57.14,24.12 63.49,24.12 63.49,27.93 57.14,27.93 57.14,48.25 63.49,48.25 63.49,53.33 -0.01,53.33 -0.01,-0.01
  pour Bottom: -0.01,-0.01 57.14,-0.01 57.14,24.12 63.49,24.12 63.49,27.93 57.14,27.93 57.14,48.25 63.49,48.25 63.49,53.33 -0.01,53.33
LED0  (via drill 0.35)
  Top 0.152: v15.54,21.9 15.54,22.28 16.59,23.32 IC2.24 | R8.2 R7.1 22.32,20.31 21.97,20.65 v21.9,20.65
  Bottom 0.152: v21.9,20.65 21.87,20.63 16.82,20.63 v15.54,21.9
LED1
  Top 0.152: R9.2 R10.2 15.36,20.97 15.48,20.97 16.47,21.96 16.47,22.76 IC2.25
LEDP1
  Top 0.152: J1.11 71.11,12.69 59.04,24.75 R6.1
LEDP4
  Top 0.152: J2.11 71.11,29.83 69.84,28.56 R12.1
N$1
  Top 0.152: LED1.A 20.73,36.82 R1.1
N$2
  Top 0.152: J2.5 C37.2
N$3
  Top 0.152: J2.4 C36.2
N$4
  Top 0.152: IC2.1 21.84,24.27 R17.1
N$5
  Top 0.152: R3.2 21.84,27.77 IC2.8
N$6
  Top 0.203: IC2.2 22.81,24.77 23.47,24.12 C14.1
N$7
  Top 0.152: R15.2 17.13,21.04 18.79,22.69 IC2.28
N$8
  Top 0.152: IC1.42 35.98,27.49 35.77,27.71 R14.1
N$9
  Top 0.152: J1.5 C35.2
N$10
  Top 0.152: J1.4 C34.2
N$11
  Top 0.305: IC2.29 19.29,20.88 18.73,20.32 C19.1
N$12  (via drill 0.35)
  Top 0.152: R6.2 v51.74,24.75 | IC1.30 42.1,31.62 v42.85,32.38
  Bottom 0.152: v42.85,32.38 46.34,32.38 51.74,26.98 v51.74,24.75
N$13  (via drill 0.35)
  Top 0.152: R12.2 v51.74,28.56 | IC1.34 40.5,31.61 v42.21,33.33
  Bottom 0.152: v42.21,33.33 46.98,33.33 v51.74,28.56
N$14
  Top 0.152: IC2.3 24.52,25.27 RN1.8
N$15
  Top 0.152: LED3.C 21.05,13.21 25.28,17.44 R8.1
N$16
  Top 0.152: IC2.4 RN1.7
N$17
  Top 0.152: IC2.5 RN1.6
N$18
  Top 0.152: IC2.6 24.52,26.77 RN1.5
N$19
  Top 0.152: R5.1 LED2.A
N$20  (via drill 0.35)
  Top 0.152: IC1.29 42.5,31.07 43.49,32.06 v43.49,33.96 | v43.49,35.55 R5.2
  Bottom 0.152: v43.49,35.55 v43.49,33.96
N$24
  Top 0.152: IC1.46 37.87,25.89 37.44,25.47 33.93,25.47 32.26,23.8 C13.1
N$26
  Top 0.152: IC1.47 37.9,25.49 37.57,25.17 34.07,25.17 C11.1
N$27
  Top 0.152: IC1.45 37.2,26.29 36.82,25.92 32.6,25.92 31.75,25.07 C8.1
N$28
  Top 0.152: C2.1 31.87,26.34 31.99,26.22 36.7,26.22 37.17,26.69 IC1.44
N$29
  Top 0.152: R9.1 LED4.A
NRST  (via drill 0.35)
  Top 0.152: v14.91,26.34 15.48,25.77 IC2.21 | v13.96,29.2 C28.1 R13.1 | IC1.27 43.3,30.7 v43.8,31.2
  Bottom 0.152: v14.91,26.34 13.96,27.29 v13.96,29.2 15.77,29.2 24.31,37.74 36.43,37.74 42.98,31.2 v43.8,31.2
PHY_INT  (via drill 0.35)
  Top 0.152: IC2.11 19.79,29.26 19.68,29.37 19.68,30.46 v19.67,30.47 | R2.1 25.07,33.01 v24.12,32.06 23.31,31.25 22.53,30.47 v21.26,30.47
  Bottom 0.152: v19.67,30.47 v21.26,30.47 | SV1.2 3.84,18.37 20.79,18.37 24.12,21.7 v24.12,32.06
RMII_CRS_DV  (via drill 0.35)
  Top 0.152: v6.97,24.22 7.03,24.27 RN2.4
  Bottom 0.152: v6.97,24.22 6.97,24.53 5.8,25.71 4.12,25.71 SV1.8
RMII_REF_CLK  (via drill 0.35)
  Top 0.152: v9.25,27.29 8.93,26.98 SV1.7 7.29,26.98 R11.2 | IC2.32 20.85,23.57 v21.58,22.85
  Bottom 0.152: v21.58,22.85 20.91,23.51 12.71,23.51 9.25,26.98 v9.25,27.29
RMII_RXD0
  Top 0.152: SV1.5 5.77,24.82 RN2.3
RMII_RXD1
  Top 0.152: SV1.6 4.15,25.75 5.8,25.75 6.22,25.32 RN2.2
RMII_TX_EN  (via drill 0.35)
  Top 0.152: RN3.4 10.28,27.11 v9.19,26.02 | SV1.3 v8.88,21.9
  Bottom 0.152: v8.88,21.9 9.19,22.21 v9.19,26.02
RMII_TXD0  (via drill 0.35)
  Top 0.152: v9.19,28.6 9.3,28.5 RN3.2
  Bottom 0.152: v9.19,28.6 9.12,28.53 7.99,28.53 7.58,28.11 7.58,23.65 6.99,23.06 4,23.06 SV1.4
RMII_TXD1  (via drill 0.35)
  Top 0.152: RN3.3 8.32,28 v8.24,27.92
  Bottom 0.152: SV1.1 8.24,22.21 v8.24,27.92
RV10  (via drill 0.35)
  Top 0.203: FL6.1 39.88,34.7 C22.+ 40.21,34.6 41.57,34.6 C25.2 43.21,34.58 43.22,34.59 43.75,34.59 44.44,33.9 44.44,33 C24.2 45.39,31.1 | IC1.36 39.99,30.24 IC1.35 | IC1.24 44.85,30.56 45.39,31.1 | v46.03,31.1 45.39,31.1 | IC1.7 42.1,17.58 C23.2 | C23.2 42.23,15.98 FL7.1 | v46.66,23.17 46.66,21.36 42.75,17.45 C23.2
  Top 0.406: C22.+ 39.99,30.24
  Bottom 0.203: v46.66,23.17 46.79,23.3 46.82,23.3 46.82,30.26 46,31.08 v46.03,31.1
RV10A  (via drill 0.35)
  Top 0.152: C29.+ 40.41,14.48
  Top 0.203: v45.07,24.12 44.85,24.34 IC1.13 47.26,25.09 C31.2 | IC1.23 45.33,29.09 45.89,29.65 | 45.89,29.65 46.98,30.74 C32.2 | IC1.43 36.5,27.09 | 36.5,27.09 35.04,27.09 C30.2 | v36.45,26.83 36.45,27.04 36.5,27.09 | 38.79,23.44 38.2,22.85 C33.2 37.47,17.86 39.46,15.87 FL7.2 40.41,14.48 | 38.79,23.44 IC1.1 | v38.79,24.05 38.79,23.44 | v45.8,29.74 45.89,29.66 45.89,29.65
  Bottom 0.203: v36.45,26.83 36.45,26.39 v38.79,24.05 45,24.05 v45.07,24.12 45.07,29.01 v45.8,29.74
RV10P  (via drill 0.35)
  Top 0.203: IC1.41 36.44,27.89 v36.23,28.1 35.77,28.56 C27.2 | C26.+ FL6.2 36.71,36.4 v35.86,35.55
  Bottom 0.203: v36.23,28.1 36.23,35.18 v35.86,35.55
RV33  (via drill 0.35)
  Top 0.203: IC1.37 38.95,30.46 v38.83,30.58 38.3,31.1 C12.2 36.2,32.36 33.64,34.91 32.69,34.91 32.64,34.97 | IC1.31 41.7,30.99 v41.26,31.42 | FL3.2 30.78,34.38 FL4.1 | FL5.1 31,36.62 FL3.2 | FL3.2 32.27,34.6 32.64,34.97 | C10.+ 32.64,34.97
  Bottom 0.203: v41.26,31.42 39.68,31.42 v38.83,30.58
RV33A  (via drill 0.35)
  Top 0.152: IC1.6 41.7,21.58 | 41.7,21.58 41.7,20.76 C17.2 | IC1.8 42.5,23.17 | 42.5,23.17 42.5,20.68 C18.2 | v42.85,23.17 42.5,23.17 | v40.95,21.58 41.7,21.58
  Top 0.203: IC1.48 38.29,24.44 v37.14,24.44 C16.2 | C15.2 46.85,27.09 45.71,27.09 | IC1.18 45.71,27.09 | FL4.2 31,30.89 v32.37,29.52 | v45.8,26.89 45.71,26.98 45.71,27.09
  Bottom 0.203: 40.31,23.17 v42.85,23.17 45.39,23.17 45.8,23.58 v45.8,26.89 | 40.31,23.17 38.4,23.17 v37.14,24.44 32.37,29.2 v32.37,29.52 | v40.95,21.58 40.31,22.21 40.31,23.17
RV33P  (via drill 0.35)
  Top 0.203: IC1.38 38.31,29.09 38,29.41 v37.77,29.41 37.35,29.83 C21.2 | FL5.2 34.6,35.76 34.6,35.29 37.77,32.12 v37.77,32.06
  Top 0.305: C20.+ 33.22,38.62 FL5.2
  Bottom 0.203: v37.77,32.06 v37.77,29.41
RXD0  (via drill 0.35)
  Top 0.152: RN2.6 11.99,24.82 12.37,24.44 v13.64,24.44 | IC2.9 21.51,29.2 v21.58,29.2
  Bottom 0.152: v21.58,29.2 16.82,24.44 v13.64,24.44
RXD1  (via drill 0.35)
  Top 0.152: v12.38,25.35 12.36,25.32 RN2.7 | R16.2 20.62,29.95 v20.29,29.62 IC2.10
  Bottom 0.152: v20.29,29.62 19.65,29.62 15.38,25.35 v12.38,25.35
RXDV  (via drill 0.35)
  Top 0.152: IC2.26 17.79,22.55 v17.77,22.53 | RN2.5 11.28,24.25 v13.01,22.53
  Bottom 0.152: v13.01,22.53 v17.77,22.53
RXIN0
  Top 0.152: RN1.2 25.93,25.77 26.09,25.61 27.48,25.61 27.99,25.1 30.11,25.1 C8.2
RXIN1  (via drill 0.35)
  Top 0.152: IC1.3 40.5,23.35 39.04,21.9 v39.04,19.04
  Bottom 0.152: v39.04,19.04 51.74,19.04 58.09,12.69 J1.6
RXIN4
  Top 0.152: IC1.21 46.39,28.29 54.92,36.82 J2.6
RXIP0  (via drill 0.35)
  Top 0.152: C2.2 28.88,26.34 v28.25,25.71 | v27.29,24.75 26.66,24.75 26.19,25.22 RN1.1
  Bottom 0.152: v28.25,25.71 v27.29,24.75
RXIP1  (via drill 0.35)
  Top 0.152: IC1.2 40.1,23.59 38.4,21.9 v38.4,19.99
  Bottom 0.152: v38.4,19.99 53.64,19.99 57.14,16.5 J1.3
RXIP4
  Top 0.152: IC1.22 45.61,28.69 51.42,34.5 51.42,38.59 53.46,40.63 J2.3
TXD0
  Top 0.152: RN3.7 17.26,28.5 IC2.16
TXD1
  Top 0.152: RN3.6 15.48,28 15.7,27.77 IC2.17
TXEN
  Top 0.152: RN3.5 14.76,27.45 15.93,26.27 IC2.20
TXON0  (via drill 0.35)
  Top 0.152: C13.2 v28.88,23.8 | v28.25,26.66 28.08,26.82 RN1.4
  Bottom 0.152: v28.88,23.8 28.88,26.02 v28.25,26.66
TXON1  (via drill 0.35)
  Top 0.152: IC1.4 40.9,23.22 39.99,22.32 v39.99,20.94
  Bottom 0.152: v39.99,20.94 54.92,20.94 58.09,17.77 J1.2
TXON4  (via drill 0.35)
  Top 0.152: J2.2 v56.18,41.9 | v52.38,33.01 47.26,27.89 IC1.20
  Bottom 0.152: v56.18,41.9 52.38,38.09 v52.38,33.01
TXOP0  (via drill 0.35)
  Top 0.152: C11.2 28.25,22.53 v27.29,23.48 | v26.66,26.22 26.66,26.27 RN1.3
  Bottom 0.152: v27.29,23.48 26.66,24.12 v26.66,26.22
TXOP1  (via drill 0.35)
  Top 0.152: IC1.5 41.3,22.76 v41.07,22.53
  Bottom 0.152: v41.07,22.53 56.18,22.53 J1.1
TXOP4  (via drill 0.35)
  Top 0.152: IC1.19 48.13,27.49 v53.64,33.01
  Bottom 0.152: v53.64,33.01 53.64,37.14 J2.1
VCC  (via drill 0.35)
  Top 0.406: Q1.4 v11.15,34.65 11.75,35.25 13.64,35.25 | Q2.4 36.45,41 34.91,42.54 30.15,42.54 | FL1.1 15.24,35.23 C3.2 13.64,35.25 | 30.15,42.54 18.61,42.54 13.64,37.57 13.64,35.25 | 30.15,42.54 30.05,42.43 C9.+ 29.2,41.27 28.25,40.31 28.25,35.65 FL3.1
  Bottom 0.406: 11.1,34.6 v11.15,34.65
  Bottom 0.508: 11.1,34.6 SV1.13 SV1.14
XI  (via drill 0.35)
  Top 0.152: IC1.40 37.35,28.29 v36.87,28.78 | Q2.3 36.45,37.46 v36.13,37.14
  Bottom 0.152: v36.13,37.14 36.13,36.5 36.87,35.77 v36.87,28.78

### Text on the board
tNames: + | + | + | + | + | + | + | + | + | + | + | + | + | + | gd32-dmx.org